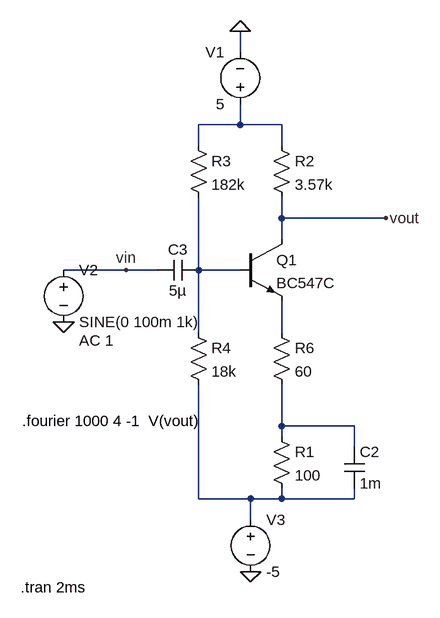
[diagram p0: schematic common_emitter_amplifier.asc]
common_emitter_amplifier.asc, the LTspice schematic file:
Version 4
SHEET 1 880 680
WIRE 240 -240 240 -272
WIRE 240 -128 240 -160
WIRE 240 -128 176 -128
WIRE 304 -128 240 -128
WIRE 176 -96 176 -128
WIRE 304 -96 304 -128
WIRE 304 16 304 -16
WIRE 464 16 304 16
WIRE 304 48 304 16
WIRE 64 96 -32 96
WIRE 112 96 64 96
WIRE 176 96 176 -16
WIRE 240 96 176 96
WIRE 176 192 176 96
WIRE 304 192 304 144
WIRE 304 336 304 272
WIRE 416 336 304 336
WIRE 304 352 304 336
WIRE 416 368 416 336
WIRE 176 448 176 272
WIRE 256 448 176 448
WIRE 304 448 304 432
WIRE 304 448 256 448
WIRE 416 448 416 432
WIRE 416 448 304 448
WIRE 256 480 256 448
FLAG 240 -272 0
FLAG -32 176 0
FLAG 256 560 0
FLAG 64 96 vin
FLAG 464 16 vout
SYMBOL npn 240 48 R0
SYMATTR InstName Q1
SYMATTR Value BC547C
SYMBOL res 288 336 R0
SYMATTR InstName R1
SYMATTR Value 100
SYMBOL res 288 -112 R0
SYMATTR InstName R2
SYMATTR Value 3.57k
SYMBOL res 160 -112 R0
SYMATTR InstName R3
SYMATTR Value 182k
SYMBOL res 160 176 R0
SYMATTR InstName R4
SYMATTR Value 18k
SYMBOL voltage 240 -144 R180
WINDOW 0 24 96 Left 2
WINDOW 3 24 16 Left 2
WINDOW 123 0 0 Left 0
WINDOW 39 0 0 Left 0
SYMATTR InstName V1
SYMATTR Value 5
SYMBOL voltage -32 80 R0
WINDOW 123 24 124 Left 2
WINDOW 39 0 0 Left 0
SYMATTR Value2 AC 1
SYMATTR InstName V2
SYMATTR Value SINE(0 100m 1k)
SYMBOL cap 400 368 R0
SYMATTR InstName C2
SYMATTR Value 1m
SYMBOL cap 176 80 R90
WINDOW 0 0 32 VBottom 2
WINDOW 3 32 32 VTop 2
SYMATTR InstName C3
SYMATTR Value 5µ
SYMBOL voltage 256 464 R0
WINDOW 123 0 0 Left 0
WINDOW 39 0 0 Left 0
SYMATTR InstName V3
SYMATTR Value -5
SYMBOL res 288 176 R0
SYMATTR InstName R6
SYMATTR Value 60
TEXT -96 328 Left 2 !.fourier 1000 4 -1  V(vout)
TEXT -98 584 Left 2 !.tran 2ms

The netlist it stands for:
* common_emitter_amplifier.asc
Q1 vout N002 N003 0 BC547C
R1 N004 N005 100
R2 N001 vout 3.57k
R3 N001 N002 182k
R4 N002 N005 18k
V1 N001 0 5
V2 vin 0 SINE(0 100m 1k) AC 1
C2 N004 N005 1m
C3 N002 vin 5µ
V3 N005 0 -5
R6 N003 N004 60
.model NPN NPN
.model PNP PNP
.lib standard.bjt
.fourier 1000 4 -1  V(vout)
.tran 2ms
.backanno
.end